# Altium schematic sheet Connectors.SchDoc
size A4
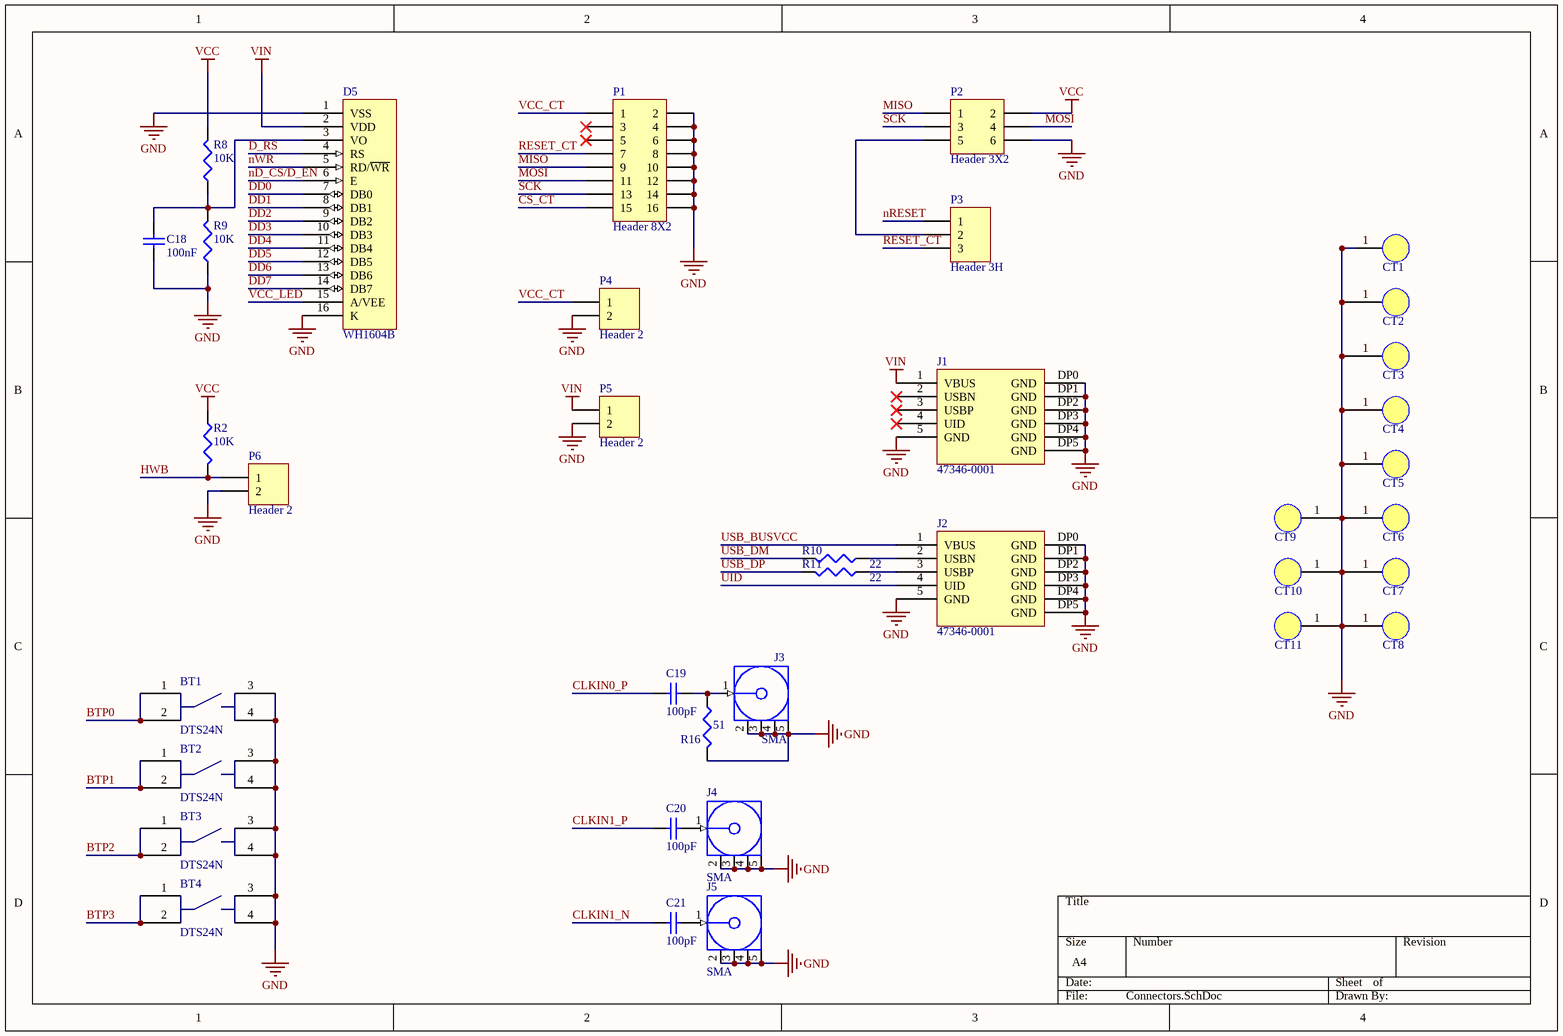
[diagram p0: Connectors.SchDoc]

## Parts
BT1  DTS24N  [DTS24N]
BT2  DTS24N  [DTS24N]
BT3  DTS24N  [DTS24N]
BT4  DTS24N  [DTS24N]
C18  100nF  [1608[0603]]
C19  100pF  [1608[0603]]
C20  100pF  [1608[0603]]
C21  100pF  [1608[0603]]
CT1  MTHOLE_3mm  [MTHOLE]  (value not drawn)
CT2  MTHOLE_3mm  [MTHOLE]  (value not drawn)
CT3  MTHOLE_3mm  [MTHOLE]  (value not drawn)
CT4  MTHOLE_3mm  [MTHOLE]  (value not drawn)
CT5  MTHOLE_3mm  [MTHOLE]  (value not drawn)
CT6  MTHOLE_3mm  [MTHOLE]  (value not drawn)
CT7  MTHOLE_3mm  [MTHOLE]  (value not drawn)
CT8  MTHOLE_3mm  [MTHOLE]  (value not drawn)
CT9  MTHOLE_3mm  [MTHOLE]  (value not drawn)
CT10  MTHOLE_3mm  [MTHOLE]  (value not drawn)
CT11  MTHOLE_3mm  [MTHOLE]  (value not drawn)
D5  WH1604B  [WH1604A]
J1  47346-0001  [USB_MICRO]
J2  47346-0001  [USB_MICRO]
J3  SMA  [SMA]
J4  SMA  [SMA]
J5  SMA  [SMA]
P1  Header 8X2  [HDR2X8]
P2  Header 3X2  [HDR2X3]
P3  Header 3H  [HDR1X3H]
P4  Header 2  [HDR1X2]
P5  Header 2  [HDR1X2]
P6  Header 2  [HDR1X2]
R2  10K  [J1-0603]
R8  10K  [J1-0603]
R9  10K  [J1-0603]
R10  22  [J1-0603]
R11  22  [J1-0603]
R16  51  [J1-0603]

## Nets
GND: BT1.3 BT1.4 BT2.3 BT2.4 BT3.3 BT3.4 BT4.3 BT4.4 C18.2 CT1.1 CT2.1 CT3.1 CT4.1 CT5.1 CT6.1 CT7.1 CT8.1 CT9.1 CT10.1 CT11.1 D5.1(VSS) D5.16(K) J1.5(GND) J1.DP0(GND) J1.DP1(GND) J1.DP2(GND) J1.DP3(GND) J1.DP4(GND) J1.DP5(GND) J2.5(GND) J2.DP0(GND) J2.DP1(GND) J2.DP2(GND) J2.DP3(GND) J2.DP4(GND) J2.DP5(GND) J3.2(GND) J3.3(GND) J3.4(GND) J3.5(GND) J4.2(GND) J4.3(GND) J4.4(GND) J4.5(GND) J5.2(GND) J5.3(GND) J5.4(GND) J5.5(GND) P1.2 P1.4 P1.6 P1.8 P1.10 P1.12 P1.14 P1.16 P2.6 P4.2 P5.2 P6.2 R9.1 R16.2
VCC: P2.2 R2.1 R8.2
VIN: D5.2(VDD) J1.1(VBUS) P5.1
BTP0: BT1.1 BT1.2
BTP1: BT2.1 BT2.2
BTP2: BT3.1 BT3.2
BTP3: BT4.1 BT4.2
CLKIN0_P: C19.2
CLKIN1_N: C21.2
CLKIN1_P: C20.2
CS_CT: P1.15
D_RS: D5.4(RS)
DD0: D5.7(DB0)
DD1: D5.8(DB1)
DD2: D5.9(DB2)
DD3: D5.10(DB3)
DD4: D5.11(DB4)
DD5: D5.12(DB5)
DD6: D5.13(DB6)
DD7: D5.14(DB7)
HWB: P6.1 R2.2
MISO: P1.9 P2.1
MOSI: P1.11 P2.4
nD_CS/D_EN: D5.6(E)
nRESET: P3.1
nWR: D5.5(RD/~{WR})
RESET_CT: P1.7 P3.3
SCK: P1.13 P2.3
UID: J2.4(UID)
USB_BUSVCC: J2.1(VBUS)
USB_DM: R10.2
USB_DP: R11.2
VCC_CT: P1.1 P4.1
VCC_LED: D5.15(A/VEE)
NetC18_1: C18.1 D5.3(VO) R8.1 R9.2
NetC19_1: C19.1 J3.1(Signal) R16.1
NetC20_1: C20.1 J4.1(Signal)
NetC21_1: C21.1 J5.1(Signal)
NetJ2_2: J2.2(USBN) R10.1
NetJ2_3: J2.3(USBP) R11.1
NetP2_5: P2.5 P3.2

Not connected (* = marked no-connect by the designer): J1 2(USBN)* 3(USBP)* 4(UID)*; P1 3* 5*

## Library data of the parts
C18-C21 = Cap Semi: Capacitor (Semiconductor SIM Model); Published: 8-Jun-2000; LatestRevisionDate: 29-May-2009; LatestRevisionNote: IPC-7351 Footprint Added.; PackageReference: C1206; Publisher: Altium Limited; PackageDescription: Chip Capacitor
  C18: Value: 100nF
  C19-C21: Value: 100pF
J1 J2 = 47346-0001: Micro USB Molex
P1 = Header 8X2: Header, 8-Pin, Dual row; LatestRevisionDate: 17-Jul-2002; LatestRevisionNote: Re-released for DXP Platform.; Publisher: Altium Limited
P2 = Header 3X2: Header, 3-Pin, Dual row; LatestRevisionDate: 17-Jul-2002; LatestRevisionNote: Re-released for DXP Platform.; Publisher: Altium Limited
P3 = Header 3H: Header, 3-Pin, Right Angle; LatestRevisionDate: 17-Jul-2002; LatestRevisionNote: Re-released for DXP Platform.; Publisher: Altium Limited
P4-P6 = Header 2: Header, 2-Pin; LatestRevisionDate: 17-Jul-2002; LatestRevisionNote: Re-released for DXP Platform.; Publisher: Altium Limited
R2 R8-R11 R16 = Res3: Resistor; Published: 8-Jun-2000; LatestRevisionDate: 29-May-2009; LatestRevisionNote: IPC-7351 Footprint Added.; PackageReference: J1-0603; Publisher: Altium Limited; PackageDescription: Chip Resistor
  R2 R8 R9: Value: 10K
  R10 R11: Value: 22
  R16: Value: 51
D5 = WH1604B: Value: WH1604B